# EAGLE design radio_board (EAGLE 6.5.0)
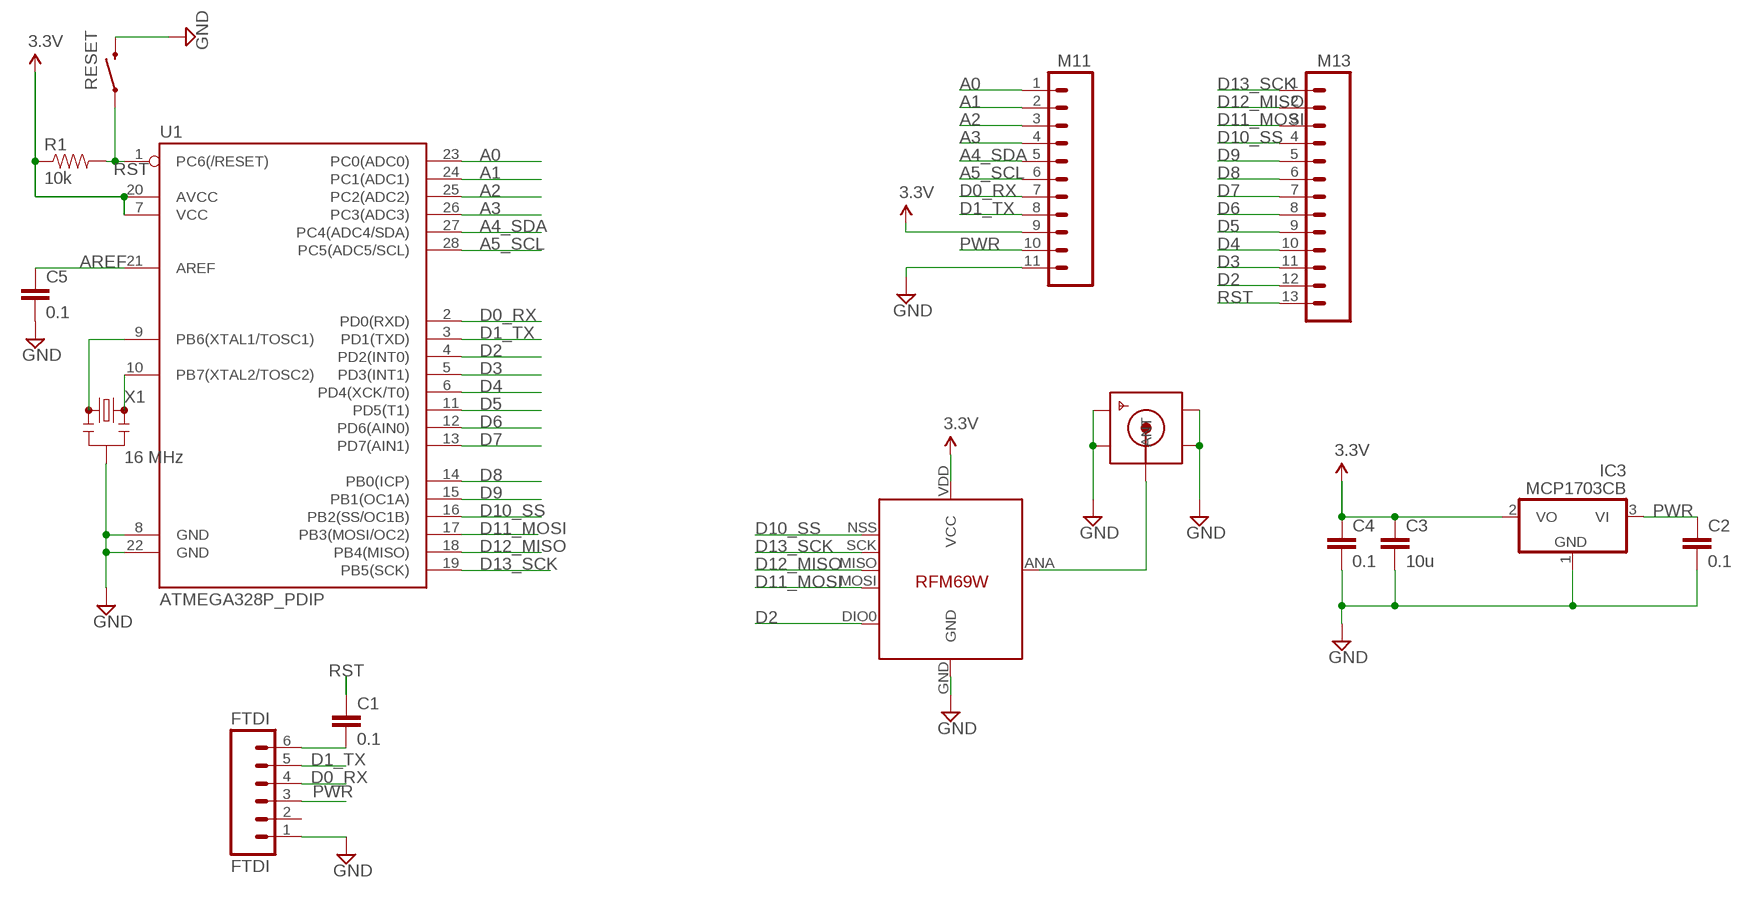
[diagram p0: schematic, sheet 1]

## Parts
C1  0.1  CAPPTH  [CAP-PTH-SMALL]
C2  0.1  CAPPTH  [CAP-PTH-SMALL]
C3  10u  CAPPTH  [CAP-PTH-SMALL]
C4  0.1  CAPPTH  [CAP-PTH-SMALL]
C5  0.1  CAPPTH  [CAP-PTH-SMALL]
DIGITALSIDE  M13  [1X13]
FTDI  FTDI  M06SIP  [1X06]
IC3  MCP1703CB  [SOT23]
M11  M11PTH  [1X11]
R1  10k  RESISTORPTH-1/4W  [AXIAL-0.4]
RESET  SWITCH-MOMENTARY-2SMD  [TACTILE-SWITCH-SMD]
SMA_CONNECTOR  SMACONNECTOR_EDGE  [SMA_EDGELAUNCH]
U1  ATMEGA328P_PDIP  [DIL28-3]
U$5  RFM69HW  RFM69  [RFM69W-MINPADS]
X1  16 MHz  RESONATORPTH  [RESONATOR-PTH]

## Nets
A0: M11.1 U1.23(PC0(ADC0))
A1: M11.2 U1.24(PC1(ADC1))
A2: M11.3 U1.25(PC2(ADC2))
A3: M11.4 U1.26(PC3(ADC3))
A4_SDA: M11.5 U1.27(PC4(ADC4/SDA))
A5_SCL: M11.6 U1.28(PC5(ADC5/SCL))
ANT: SMA_CONNECTOR.P(ANT) U$5.ANA(ANT)
AREF: C5.1 U1.21(AREF)
D0_RX: FTDI.4 M11.7 U1.2(PD0(RXD))
D1_TX: FTDI.5 M11.8 U1.3(PD1(TXD))
D2: DIGITALSIDE.12 U1.4(PD2(INT0)) U$5.DIO0
D3: DIGITALSIDE.11 U1.5(PD3(INT1))
D4: DIGITALSIDE.10 U1.6(PD4(XCK/T0))
D5: DIGITALSIDE.9 U1.11(PD5(T1))
D6: DIGITALSIDE.8 U1.12(PD6(AIN0))
D7: DIGITALSIDE.7 U1.13(PD7(AIN1))
D8: DIGITALSIDE.6 U1.14(PB0(ICP))
D9: DIGITALSIDE.5 U1.15(PB1(OC1A))
D10_SS: DIGITALSIDE.1 U1.16(PB2(SS/OC1B)) U$5.NSS(SEL)
D11_MOSI: DIGITALSIDE.2 U1.17(PB3(MOSI/OC2)) U$5.MOSI
D12_MISO: DIGITALSIDE.3 U1.18(PB4(MISO)) U$5.MISO
D13_SCK: DIGITALSIDE.4 U1.19(PB5(SCK)) U$5.SCK
GND [power]: C2.2 C3.2 C4.2 C5.2 FTDI.1 IC3.1(GND) M11.11 RESET.3 SMA_CONNECTOR.GND@1(GND4) SMA_CONNECTOR.GND@2(GND3) SMA_CONNECTOR.GND@3(GND2) SMA_CONNECTOR.GND@4(GND1) U1.8(GND) U1.22(GND) U$5.GND X1.2
N$1: U1.9(PB6(XTAL1/TOSC1)) X1.1
N$20: C1.2 FTDI.6
N$21: U1.10(PB7(XTAL2/TOSC2)) X1.3
PWR [power]: C2.1 FTDI.3 IC3.3(VI) M11.10
RST: C1.1 DIGITALSIDE.13 R1.P$2 RESET.1 U1.1(PC6(/RESET))
VCC: C3.1 C4.1 IC3.2(VO) M11.9 R1.P$1 U1.7(VCC) U1.20(AVCC) U$5.VDD(VCC) ; supply symbol labelled 3.3V
Unconnected: FTDI.2

## Library data of the parts
C1-C5 = SparkFun-Passives:CAP: Capacitor Standard 0603 ceramic capacitor, and 0.1" leaded capacitor.
DIGITALSIDE = SparkFun-Connectors:M13: 13-pin single row .1" header
FTDI = SparkFun-Connectors:M06: Header 6 Standard 6-pin 0.1" header. Use with straight break away headers (SKU : PRT-00116), right angle break away headers (PRT-00553), swiss pins (PRT-00743), machine pins (PRT-00117), and female headers (PRT-00115). Molex polarized connector foot print use with SKU : PRT-08094 with associated crimp pins and housings. NOTES ON THE VARIANTS LOCK and LOCK_LONGPADS... This footprint was designed to help hold the alignment of a through-hole component (i.e. 6-pin header) while soldering it into place. You may notice that each hole has been shifted either up or down by 0.005 of an inch from it's more standard position (which is a perfectly straight line). This slight alteration caused the pins (the squares in the middle) to touch the edges of the holes. Because they are alternating, it causes a "brace" to hold the component in place. 0.005 has proven to be the perfect amount of "off-center" position when using our standard breakaway headers. Although looks a little odd when you look at the bare footprint, once you have a header in there, the alteration is very hard to notice. Also, if you push a header all the way into place, it is covered up entirely on the bottom side. This idea of altering the position of holes to aid alignment will be further integrated into the Sparkfun Library for other footprints. It can help hold any component with 3 or more connection pins.
IC3 = linear:MCP1703: 250 mA, 16V, Low Quiescent Current LDO Regulator Source: http://ww1.microchip.com/downloads/en/DeviceDoc/22049b.pdf
M11 = SparkFun-Connectors:M11: Header 11 Standard 11-pin 0.1" header. Use with straight break away headers (SKU : PRT-00116), right angle break away headers (PRT-00553), swiss pins (PRT-00743), machine pins (PRT-00117), and female headers (PRT-00115).
R1 = SparkFun-Passives:RESISTOR: Resistor Basic schematic elements and footprints for 0603, 1206, and PTH resistors.
RESET = SparkFun-Electromechanical:SWITCH-MOMENTARY-2: Various NO switches- pushbuttons, reed, etc; PROD_ID: SWCH-08247
SMA_CONNECTOR = adafruit:SMACONNECTOR: SMA Connector 90° DIP SMA Connector, 50 Ohm (4UConnector: 07259)
U1 = SparkFun-DigitalIC:ATMEGA328P_PDIP: uC used in the Arduino 32kb flash, 1k EEPROM, 2k SRAM This is the through-hole version of this chip.
U$5 = LowPowerLab:RFM69
X1 = SparkFun-FreqCtrl:RESONATOR: Resonator Small SMD resonator. Used, eg, on the Arduino Pro/ Pro Mini boards. 8MHz- XTAL-08895 16MHz- XTAL-08900

## Net classes
1 power: width 0.381 mm, clearance 0.254 mm

## Board
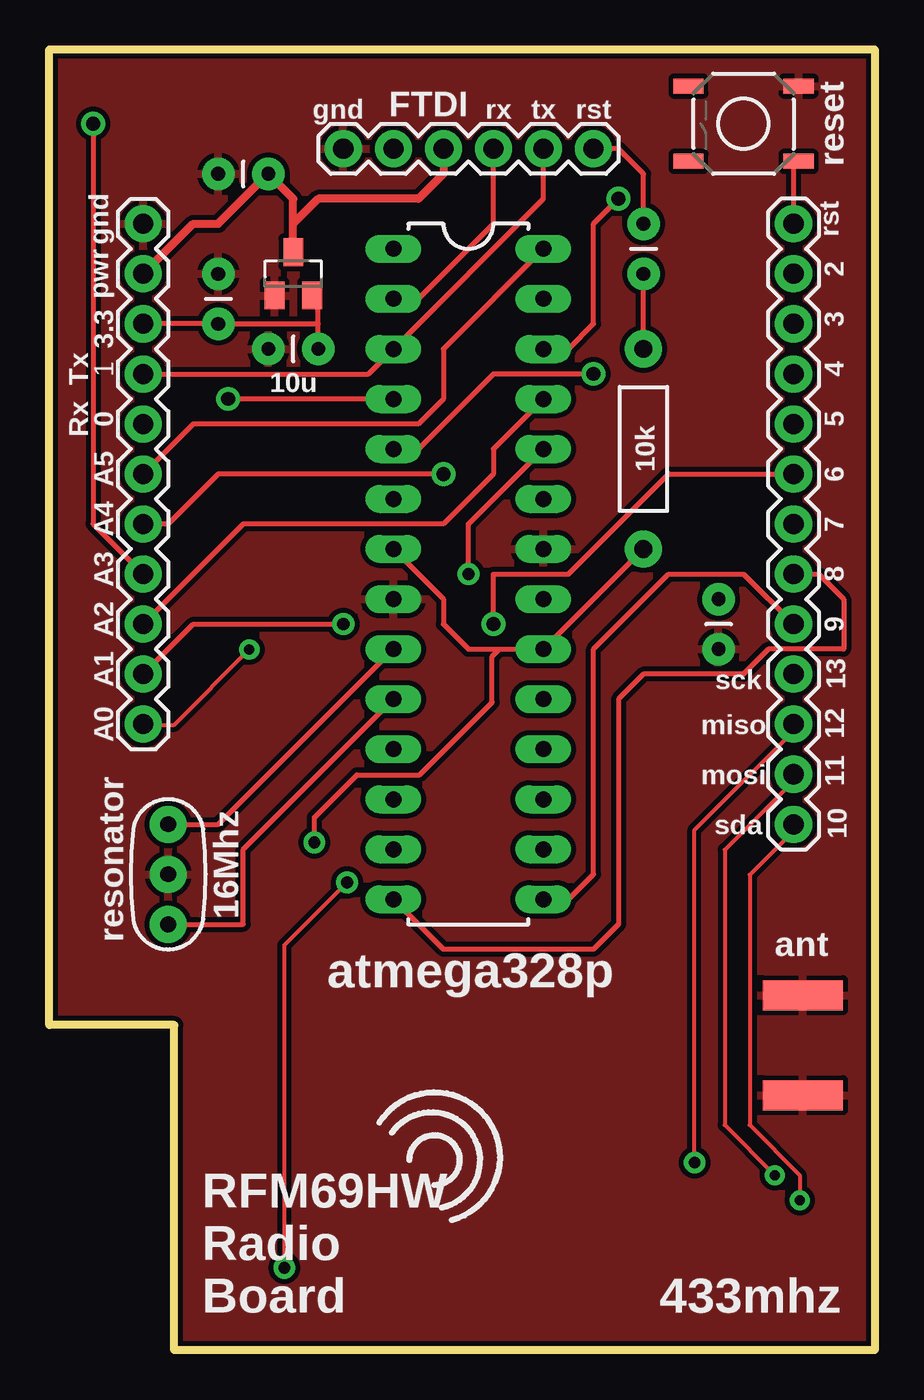
[diagram p1: board, top side]
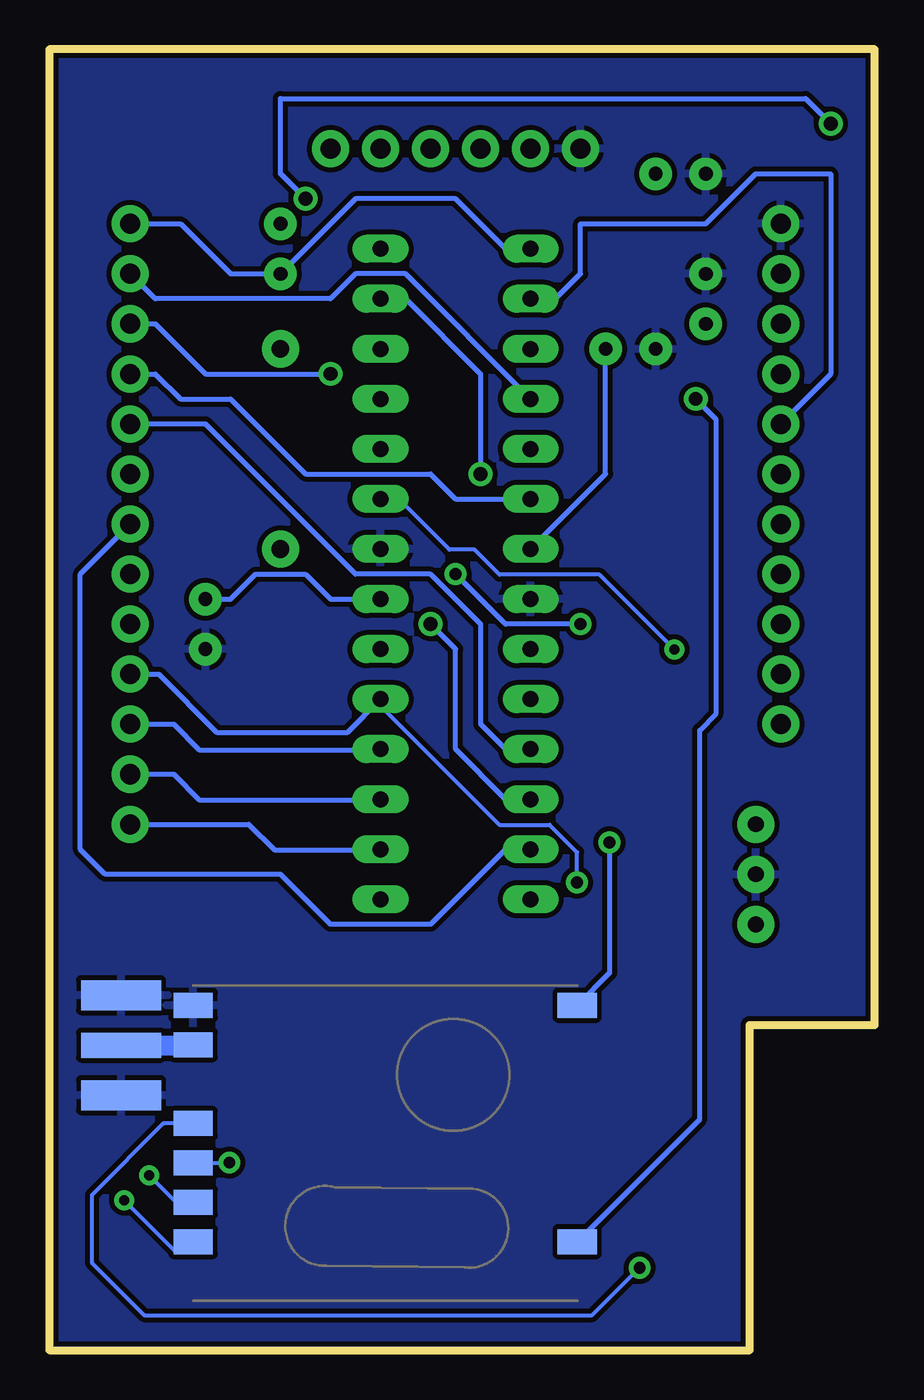
[diagram p2: board, bottom side, seen from below]

Size 41.91 x 66.04 mm. Coordinates in mm from the lower left corner, seen from the top.
Outline: 0,66.04 41.91,66.04 41.91,0 6.35,0 6.35,16.51 0,16.51 0,66.04
Copper layers (1*16): Top 0.035mm / dielectric 1.5mm / Bottom 0.035mm
Design rules "SparkFun": minimum track width 8mil, minimum drill 20mil, track to track 8mil, track to pad 8mil, pad to pad 8mil, via to via 8mil, smd to smd 8mil, copper to edge 10mil, drill to drill 8mil, minimum pad ring 12mil, minimum via ring 10mil, stop-mask expansion 4mil, vias tented up to drill 25mil, thermal gap 10mil

### Footprints (pad centres in the part's own frame; a part is rotated, then mirrored left to right if it is on the bottom)
CAP-PTH-SMALL = drill 0.7 pad 1.651: 1 0,0; 2 2.54,0
1X13 = drill 1.016 pad 1.88: 1 0,0; 2 2.54,0; 3 5.08,0; 4 7.62,0; 5 10.16,0; 6 12.7,0; 7 15.24,0; 8 17.78,0; 9 20.32,0; 10 22.86,0; 11 25.4,0; 12 27.94,0; 13 30.48,0
1X06 = drill 1.016 pad 1.88: 1 0,0; 2 2.54,0; 3 5.08,0; 4 7.62,0; 5 10.16,0; 6 12.7,0
SOT23 = smd 1 x 1.4: 1 -0.95,-1.1; 2 0.95,-1.1; 3 0,1.1
1X11 = drill 1.016 pad 1.88: 1 0,0; 2 2.54,0; 3 5.08,0; 4 7.62,0; 5 10.16,0; 6 12.7,0; 7 15.24,0; 8 17.78,0; 9 20.32,0; 10 22.86,0; 11 25.4,0
AXIAL-0.4 = drill 0.9 pad 1.88: P$1 -5.08,0; P$2 5.08,0
TACTILE-SWITCH-SMD = smd 1.524 x 0.762: 1 -2.794,1.905; 2 2.794,1.905; 3 -2.794,-1.905; 4 2.794,-1.905
SMA_EDGELAUNCH = smd 4.064 x 1.524: GND@1 2.032,-2.54; GND@2 2.032,2.54 | smd 4.064 x 1.524 bottom: GND@3 2.032,2.54; GND@4 2.032,-2.54 | smd 4.064 x 1.27: P 2.032,0
DIL28-3 = drill 0.813 long: 1 -16.51,-3.81; 2 -13.97,-3.81; 3 -11.43,-3.81; 4 -8.89,-3.81; 5 -6.35,-3.81; 6 -3.81,-3.81; 7 -1.27,-3.81; 8 1.27,-3.81; 9 3.81,-3.81; 10 6.35,-3.81; 11 8.89,-3.81; 12 11.43,-3.81; 13 13.97,-3.81; 14 16.51,-3.81; 15 16.51,3.81; 16 13.97,3.81; 17 11.43,3.81; 18 8.89,3.81; 19 6.35,3.81; 20 3.81,3.81; 21 1.27,3.81; 22 -1.27,3.81; 23 -3.81,3.81; 24 -6.35,3.81; 25 -8.89,3.81; 26 -11.43,3.81; 27 -13.97,3.81; 28 -16.51,3.81
RFM69W-MINPADS = smd 2 x 1.27: ANA 8,-5; DIO0 -11.5,5; GND 8,-7; MISO 8,1; MOSI 8,3; NSS 8,5; SCK 8,-1; VDD -11.5,-7
RESONATOR-PTH = drill 0.8 pad 1.88: 1 -2.54,0; 2 0,0; 3 2.54,0

### Placement (x,y rotation side)
C1  30.17,54.64 90 top
C2  11.12,59.72 180 top
C3  13.66,50.83 180 top
C4  8.58,52.1 90 top
C5  33.98,38.13 270 top
DIGITALSIDE  37.79,26.7 90 top
FTDI  14.93,60.99 0 top
IC3  12.39,54.64 0 top
M11  4.77,31.78 90 top
R1  30.17,45.75 90 top
RESET  35.25,62.26 180 top
SMA_CONNECTOR  40.3,15.48 0 bottom
U1  21.28,39.4 270 top
U$5  26.61,10.51 180 bottom
X1  6.04,24.16 270 top

### Tracks (layer width: path | path; a pad name or v marks a point on that pad's centre or on a via)
A0  (via drill 0.51)
  Top 0.203: v10.16,35.56 6.35,31.75 5.08,31.75 M11.1
  Bottom 0.203: v10.16,35.56 13.97,39.37 19.05,39.37 20.32,40.64 21.59,40.64 24.13,43.18 U1.23
A1  (via drill 0.61)
  Top 0.254: U1.24 21.28,41.94 v21.28,39.4 | v14.93,36.86 7.31,36.86 M11.2
  Bottom 0.254: v21.28,39.4 18.74,36.86 v14.93,36.86
A2
  Top 0.254: U1.25 22.55,45.75 22.55,44.48 20.01,41.94 9.85,41.94 M11.3
A3  (via drill 0.7)
  Top 0.254: U1.26 26.36,50.83 27.63,52.1 27.63,57.18 v28.9,58.45 | v2.23,62.26 2.23,41.94 M11.4
  Bottom 0.254: v28.9,58.45 30.17,59.72 30.17,63.53 3.5,63.53 v2.23,62.26
A4_SDA  (via drill 0.7)
  Top 0.254: v20.01,44.48 8.58,44.48 6.04,41.94 M11.5
  Bottom 0.254: U1.27 23.82,53.37 20.01,49.56 v20.01,44.48
A5_SCL
  Top 0.254: U1.28 20.01,50.83 20.01,48.29 18.74,47.02 7.31,47.02 M11.6
ANT
  Bottom 1.016: SMA_CONNECTOR.P 34.76,15.48 U$5.ANA
AREF
  Bottom 0.254: C5.1 32.71,38.13 31.44,39.4 28.9,39.4 27.63,38.13 U1.21
D0_RX
  Top 0.254: U1.2 18.74,53.37 22.55,57.18 FTDI.4
  Bottom 0.254: U1.2 16.2,53.37 14.93,54.64 14.93,57.18 8.58,57.18 6.04,59.72 2.23,59.72 2.23,49.56 M11.7
D1_TX
  Top 0.254: FTDI.5 25.09,58.45 U1.3 16.2,49.56 M11.8
D2  (via drill 0.7)
  Top 0.254: U1.4 v9.09,48.29
  Bottom 0.254: U1.4 23.82,54.64 26.36,54.64 27.63,53.37 36.52,53.37 DIGITALSIDE.12 | v9.09,48.29 8.07,47.27 8.07,32.29 8.89,31.47 8.89,11.73 U$5.DIO0
D3  (via drill 0.7)
  Top 0.254: U1.5 18.74,45.75 22.55,49.56 v27.63,49.56
  Bottom 0.254: DIGITALSIDE.11 36.52,52.1 33.98,49.56 v27.63,49.56
D4
  Bottom 0.254: DIGITALSIDE.10 36.52,49.56 35.25,48.29 32.71,48.29 28.9,44.48 22.55,44.48 21.28,43.21 U1.6
D5
  Bottom 0.254: U1.11 18.74,30.51 20.01,31.78 20.01,36.86 22.55,39.4 26.36,39.4 33.98,47.02 DIGITALSIDE.9
D6  (via drill 0.7)
  Top 0.254: v22.55,36.86 22.55,39.4 26.36,39.4 31.44,44.48 DIGITALSIDE.8
  Bottom 0.254: U1.12 18.74,27.97 21.28,30.51 21.28,35.59 v22.55,36.86
D7
  Bottom 0.254: U1.13 18.74,25.43 22.55,21.62 27.63,21.62 30.17,24.16 39.06,24.16 40.33,25.43 40.33,39.4 DIGITALSIDE.7
D8
  Top 0.254: DIGITALSIDE.6 39.06,39.4 40.33,38.13 40.33,35.59 36.52,35.59 35.25,34.32 30.17,34.32 28.9,33.05 28.9,21.62 27.63,20.35 20.01,20.35 U1.14
D9
  Top 0.254: U1.15 26.36,22.89 27.63,24.16 27.63,35.59 31.44,39.4 35.25,39.4 DIGITALSIDE.5
D10_SS  (via drill 0.51)
  Top 0.203: v38.1,7.62 38.1,8.89 35.56,11.43 35.56,24.13 38.1,26.67 DIGITALSIDE.1
  Bottom 0.203: v38.1,7.62 35.56,5.08 U$5.NSS
  Bottom 0.254: DIGITALSIDE.1 31.78,26.7 30.48,25.4 25.12,25.4 U1.16
D11_MOSI  (via drill 0.51)
  Top 0.203: v36.83,8.89 34.29,11.43 34.29,25.4 38.1,29.21 DIGITALSIDE.2
  Bottom 0.203: v36.83,8.89 35.56,7.62 U$5.MOSI
  Bottom 0.254: DIGITALSIDE.2 35.59,29.24 34.29,27.94 25.12,27.94 U1.17
D12_MISO  (via drill 0.6)
  Top 0.203: DIGITALSIDE.3 38.1,31.75 32.77,26.42 v32.77,9.53
  Bottom 0.203: U$5.MISO 32.78,9.51 v32.77,9.53
  Bottom 0.254: DIGITALSIDE.3 35.59,31.78 34.29,30.48 25.12,30.48 U1.18
D13_SCK  (via drill 0.6)
  Top 0.203: v11.94,4.19 11.94,20.57 v15.11,23.75
  Bottom 0.203: U1.19 25.4,33.02 19.05,26.67 16.51,26.67 15.11,25.27 v15.11,23.75 | U$5.SCK 36.12,11.51 39.75,7.87 39.75,4.45 37.08,1.78 14.35,1.78 v11.94,4.19
  Bottom 0.254: U1.19 26.77,31.37 33.4,31.37 36.35,34.32 DIGITALSIDE.4
GND
  pour Bottom: 0,66.04 41.91,66.04 41.91,0 6.35,0 6.35,16.51 0,16.51
  pour Top: 0,66.04 0,16.51 6.35,16.51 6.35,0 41.91,0 41.91,66.04
N$1
  Top 0.254: X1.1 8.58,26.7 U1.9
N$20
  Top 0.254: C1.2 30.17,59.72 28.9,60.99 FTDI.6
N$21
  Top 0.254: X1.3 9.85,21.62 9.85,25.43 U1.10
PWR
  Top 0.406: IC3.3 12.39,57.18 | 12.39,57.18 12.39,58.45 C2.1 8.58,57.18 7.31,57.18 M11.10 | FTDI.3 20.01,59.72 18.74,58.45 13.66,58.45 12.39,57.18
RST
  Top 0.254: R1.P$2 C1.1 | DIGITALSIDE.13 37.79,60.1 RESET.1
  Bottom 0.254: U1.1 18.74,55.91 21.28,58.45 26.36,58.45 C1.1 32.71,54.64 35.25,57.18 DIGITALSIDE.13
VCC  (via drill 0.6)
  Top 0.254: C3.1 13.66,52.1 | 13.66,52.1 13.66,53.22 IC3.2 | M11.9 C4.1 13.66,52.1 | R1.P$1 U1.20 22.86,35.59 | U1.7 20.01,38.13 20.01,36.86 21.28,35.59 22.86,35.59 | 22.86,35.59 22.48,35.21 22.48,32.89 18.8,29.21 15.62,29.21 13.46,27.05 v13.46,25.78
  Bottom 0.254: U1.7 13.66,44.48 C3.1 | v13.46,25.78 13.46,19.15 U$5.VDD

### Text on the board
tPlace: FTDI | gnd | rx | tx | rst | reset | gnd | rst | pwr | 2 | 3 | 3.3 | Tx | 1 | 4 | 10u | Rx | 0 | 5 | A5 | 10k | 6 | A4 | 7 | A3 | 8 | A2 | 9 | A1 | 13 | sck | A0 | miso | 12 | mosi | 11 | sda | 10 | resonator | 16Mhz | ant | atmega328p | RFM69HW / Radio / Board | 433mhz